# Altium schematic sheet THIEA3000 LIGHTING BOARD V2-2.SchDoc
size B; SheetNumber: 0; SheetTotal: 0
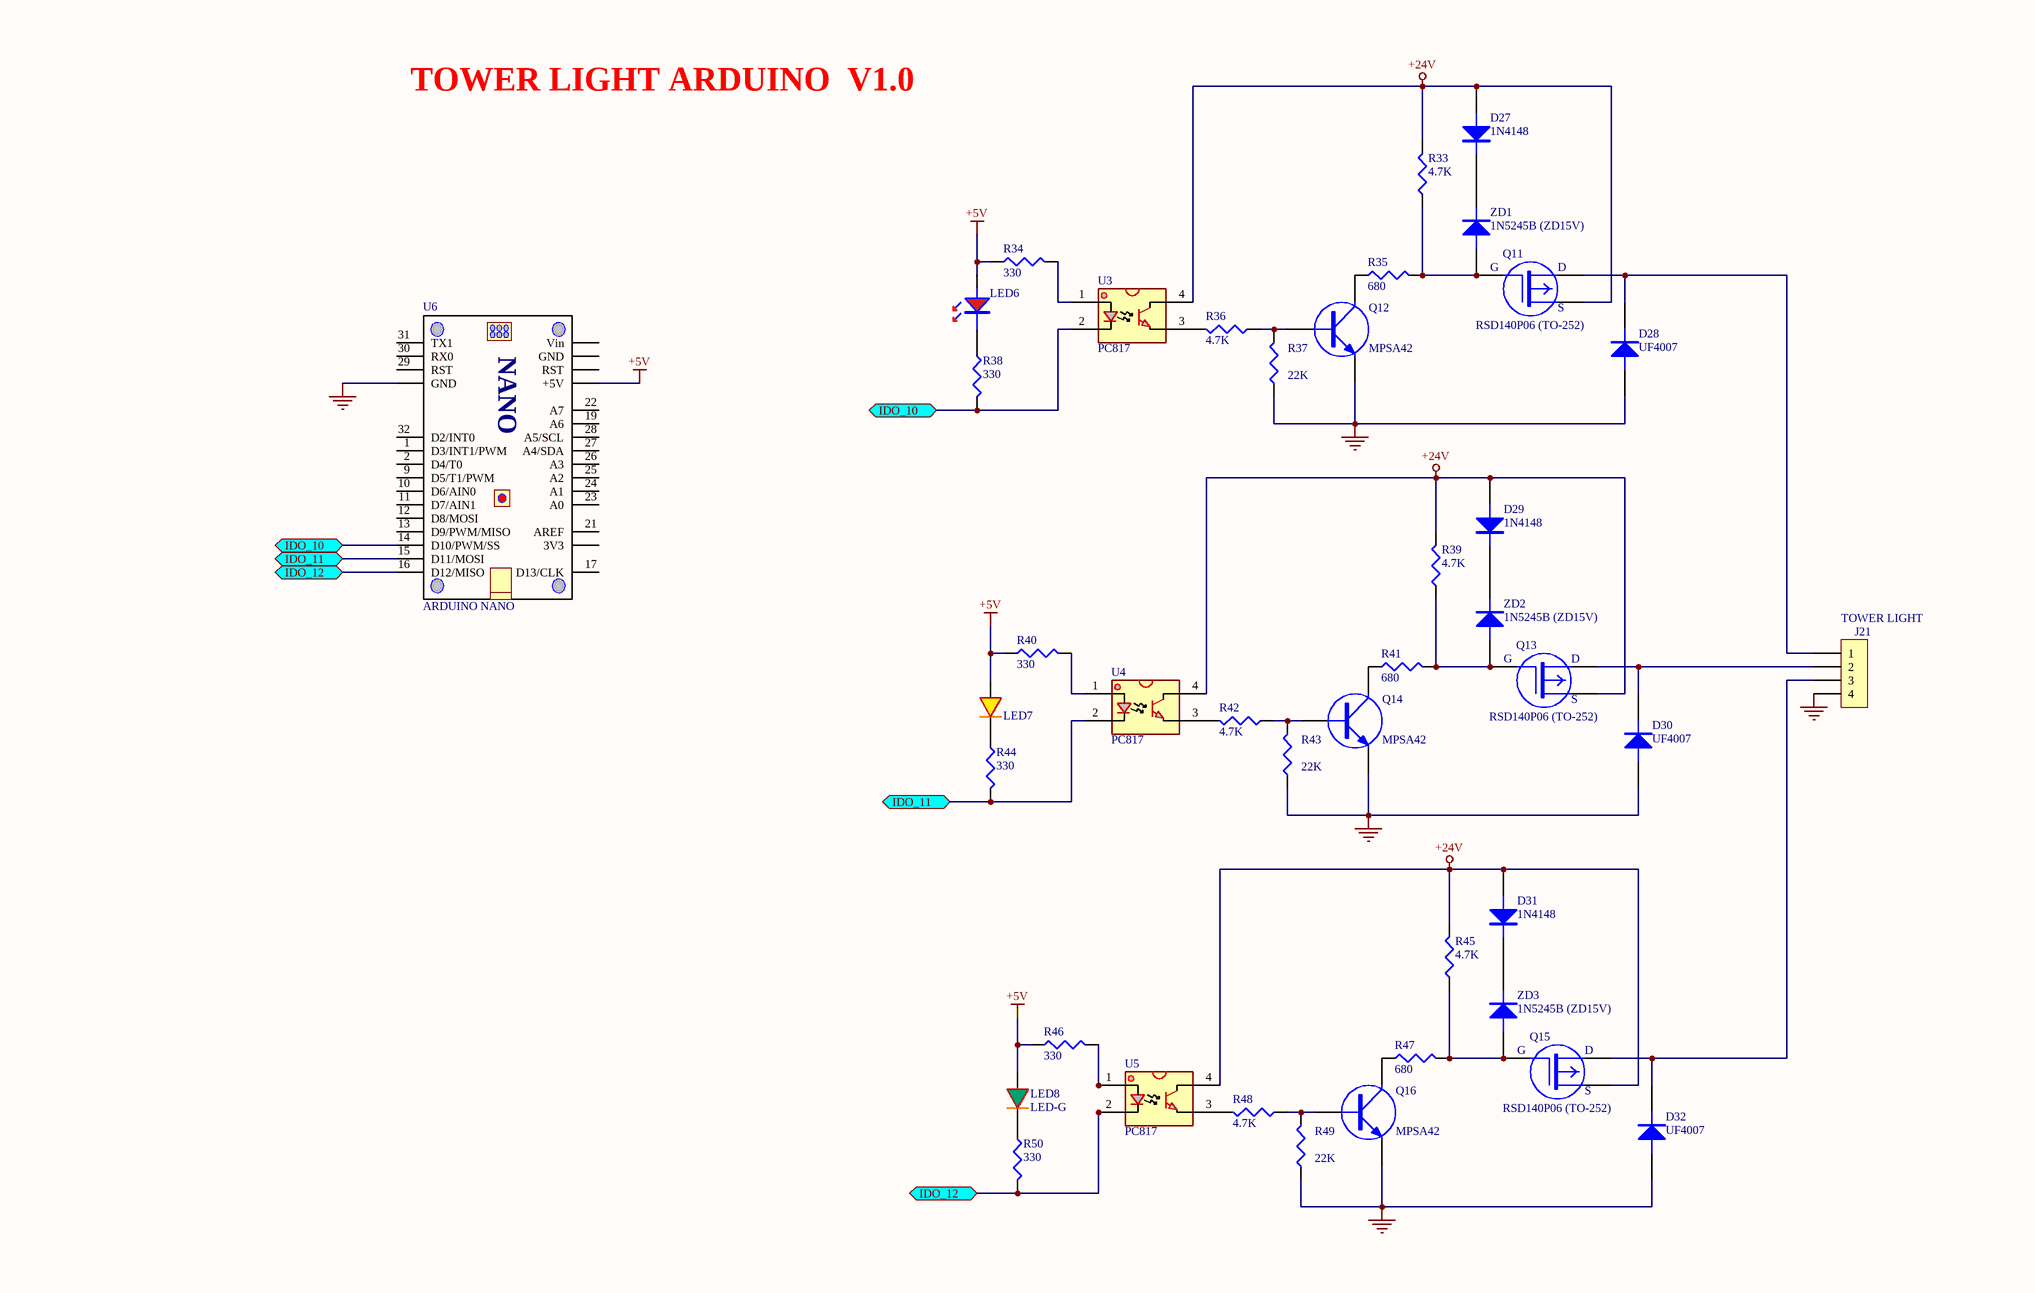
[diagram p0: THIEA3000 LIGHTING BOARD V2-2.SchDoc]

## Parts
D27  1N4148  [DIODE 8.5]
D28  UF4007  [diode 13.0]
D29  1N4148  [DIODE 8.5]
D30  UF4007  [diode 13.0]
D31  1N4148  [DIODE 8.5]
D32  UF4007  [diode 13.0]
J21  TOWER LIGHT  [Plug-in TERM 5.0/4P/R]
LED6  (no value)  [LED 3/2.54/R]
LED7  LED-Y  [LED 3/2.54/R]  (value not drawn)
LED8  LED-G  [LED 5/2.54/R]
Q11  RSD140P06 (TO-252)  [TO-252-3]
Q12  MPSA42  [TO-92]
Q13  RSD140P06 (TO-252)  [TO-252-3]
Q14  MPSA42  [TO-92]
Q15  RSD140P06 (TO-252)  [TO-252-3]
Q16  MPSA42  [TO-92]
R33  22K  [RES 1/4]  (value not drawn)
R34  22K  [RES 1/4]  (value not drawn)
R35  680  [RES 1/4]
R36  22K  [RES 1/4]  (value not drawn)
R37  22K  [RES 1/4]
R38  22K  [RES 1/4]  (value not drawn)
R39  22K  [RES 1/4]  (value not drawn)
R40  22K  [RES 1/4]  (value not drawn)
R41  680  [RES 1/4]
R42  22K  [RES 1/4]  (value not drawn)
R43  22K  [RES 1/4]
R44  22K  [RES 1/4]  (value not drawn)
R45  22K  [RES 1/4]  (value not drawn)
R46  22K  [RES 1/4]  (value not drawn)
R47  680  [RES 1/4]
R48  22K  [RES 1/4]  (value not drawn)
R49  22K  [RES 1/4]
R50  22K  [RES 1/4]  (value not drawn)
U3  PC817  [DIP-4L]
U4  PC817  [DIP-4L]
U5  PC817  [DIP-4L]
U6  ARDUINO NANO  [ARDUINO Nano]
ZD1  1N5245B (ZD15V)  [DIODE 8.5]
ZD2  1N5245B (ZD15V)  [DIODE 8.5]
ZD3  1N5245B (ZD15V)  [DIODE 8.5]

## Ports
IDO_10, IDO_11, IDO_12

## Nets
+5V: LED6.A LED7.A LED8.A R34.1 R40.1 R46.1 U6.+5V
+24V: D27.1(A) D29.1(A) D31.1(A) Q11.2(D) Q13.2(D) Q15.2(D) R33.2 R39.2 R45.2 U3.4(C) U4.4(C) U5.4(C)
GND1: D28.1(A) D30.1(A) D32.1(A) J21.4 Q12.3(E) Q14.3(E) Q16.3(E) R37.1 R43.1 R49.1 U6.GND
IDO_10: R38.2 U3.2(K) U6.14(D10/PWM/SS) ; port IDO_10
IDO_11: R44.2 U4.2(K) U6.15(D11/MOSI) ; port IDO_11
IDO_12: R50.2 U5.2(K) U6.16(D12/MISO) ; port IDO_12
NetD27_2: D27.2(K) ZD1.2(K)
NetD28_2: D28.2(K) J21.1 Q11.3(S)
NetD29_2: D29.2(K) ZD2.2(K)
NetD30_2: D30.2(K) J21.2 Q13.3(S)
NetD31_2: D31.2(K) ZD3.2(K)
NetD32_2: D32.2(K) J21.3 Q15.3(S)
NetLED6_K: LED6.K R38.1
NetLED7_K: LED7.K R44.1
NetLED8_K: LED8.K R50.1
NetQ11_1: Q11.1(G) R33.1 R35.2 ZD1.1(A)
NetQ12_1: Q12.1(B) R36.1 R37.2
NetQ12_2: Q12.2(C) R35.1
NetQ13_1: Q13.1(G) R39.1 R41.2 ZD2.1(A)
NetQ14_1: Q14.1(B) R42.1 R43.2
NetQ14_2: Q14.2(C) R41.1
NetQ15_1: Q15.1(G) R45.1 R47.2 ZD3.1(A)
NetQ16_1: Q16.1(B) R48.1 R49.2
NetQ16_2: Q16.2(C) R47.1
NetR34_2: R34.2 U3.1(A)
NetR36_2: R36.2 U3.3(E)
NetR40_2: R40.2 U4.1(A)
NetR42_2: R42.2 U4.3(E)
NetR46_2: R46.2 U5.1(A)
NetR48_2: R48.2 U5.3(E)

Not connected (* = marked no-connect by the designer): U6 1(D3/INT1/PWM) 2(D4/T0) 3V3 9(D5/T1/PWM) 10(D6/AIN0) 11(D7/AIN1) 12(D8/MOSI) 13(D9/PWM/MISO) 17(D13/CLK) 19(A6) 21(AREF) 22(A7) 23(A0) 24(A1) 25(A2) 26(A3) 27(A4/SDA) 28(A5/SCL) 29(RST) 30(RX0) 31(TX1) 32(D2/INT0) RST Vin

## Notes on the sheet
- TOWER LIGHT ARDUINO  V1.0
- (near Q11) G
- (near Q11) D
- (near Q11) S
- (near Q13) G
- (near Q13) D
- (near Q13) S
- (near Q15) G
- (near Q15) D
- (near Q15) S
- (in symbol ARDUINO NANO) NANO
- (in symbol RES1) 4.7K; 330

## Library data of the parts
D27 D29 D31 = DIODE
D28 D30 D32 = DIODE: 0029-0179-1
J21 = CON4: 0005-0012-5
LED6 = LED-R: 0302-0042-3
LED7 = LED-Y: 0686-0022-4
LED8 = LED-G: 0302-0001-4
Q11 = MOSFET-P1: 0176-0392-4; pin to pad: 2>3
Q12 Q14 Q16 = NPN: 0123-0670-5; pin to pad: 1>2 2>1
Q13 Q15 = MOSFET-P1: 0176-0392-4; pin to pad: 2>3 3>2
R33-R50 = RES1
U3-U5 = OPTO TRANSISTOR
ZD1-ZD3 = DIODE: 0135-0081-3